# Altium schematic sheet POWER_CORE.SchDoc
size A4
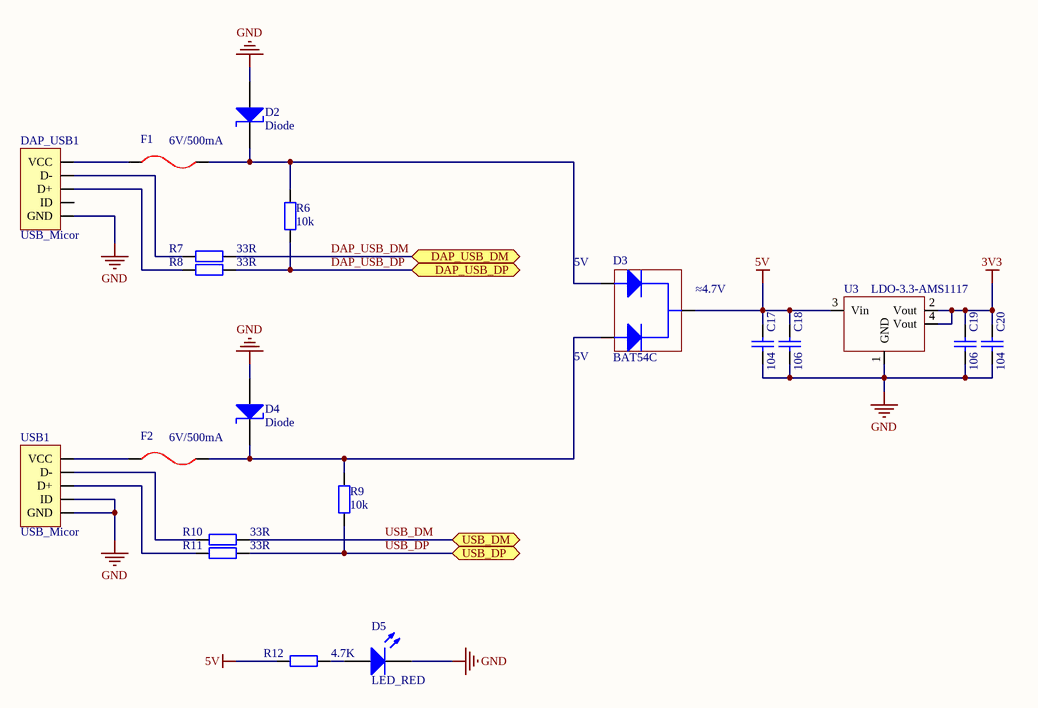
[diagram p0: POWER_CORE.SchDoc]

## Parts
C17  104  [C_SOP_0603]
C18  106  [C_SOP_0603]
C19  106  [C_SOP_0603]
C20  104  [C_SOP_0603]
D2  Diode  [SOD-123]
D3  BAT54C  [SOT23_3]
D4  Diode  [SOD-123]
D5  LED_RED  [LED_0603_R]
DAP_USB1  USB_Micor  [USB_Micor]
F1  6V/500mA  [FUSE_0603]
F2  6V/500mA  [FUSE_0603]
R6  10k  [R_SMD_0603]
R7  33R  [R_SMD_0603]
R8  33R  [R_SMD_0603]
R9  10k  [R_SMD_0603]
R10  33R  [R_SMD_0603]
R11  33R  [R_SMD_0603]
R12  4.7K  [R_SMD_0603]
U3  LDO-3.3-AMS1117  [SOT223_3]
USB1  USB_Micor  [USB_Micor]

## Ports
DAP_USB_DM (bidir), DAP_USB_DP (bidir), USB_DM (bidir), USB_DP (bidir)

## Nets
3V3: C19.2 C20.2 U3.2(Vout) U3.4(Vout)
5V: C17.2 C18.2 D3.3 R12.2 U3.3(Vin)
GND: C17.1 C18.1 C19.1 C20.1 D2.1(A) D4.1(A) D5.2(K) DAP_USB1.5(GND) U3.1(GND) USB1.4(ID) USB1.5(GND)
DAP_USB_DM: R7.2 ; port DAP_USB_DM
DAP_USB_DP: R6.1 R8.2 ; port DAP_USB_DP
USB_DM: R10.2 ; port USB_DM
USB_DP: R9.1 R11.2 ; port USB_DP
NetD2_2: D2.2(K) D3.1 F1.2 R6.2
NetD3_2: D3.2 D4.2(K) F2.2 R9.2
NetD5_1: D5.1(A) R12.1
NetDAP_USB1_1: DAP_USB1.1(VCC) F1.1
NetDAP_USB1_2: DAP_USB1.2(D-) R7.1
NetDAP_USB1_3: DAP_USB1.3(D+) R8.1
NetF2_1: F2.1 USB1.1(VCC)
NetR10_1: R10.1 USB1.2(D-)
NetR11_1: R11.1 USB1.3(D+)

Not connected (* = marked no-connect by the designer): DAP_USB1 4(ID)

## Notes on the sheet
- (near D3) 5V
- (near D3) ≈4.7V

## Library data of the parts
C17-C20 = Cap: 电容_无极性
D2 D4 = Diode: 肖特基二极管 / 1N4007、SS24
D3 = BAT54C: 肖特基二极管*2
D5 = LED: 发光二极管
F1 F2 = FUSE: 自恢复保险丝
R6-R11 = Res: 电阻
R12 = Res
U3 = LDO-3.3-AMS1117: LDO